# EAGLE design Single_Driver (EAGLE 8.5.2)
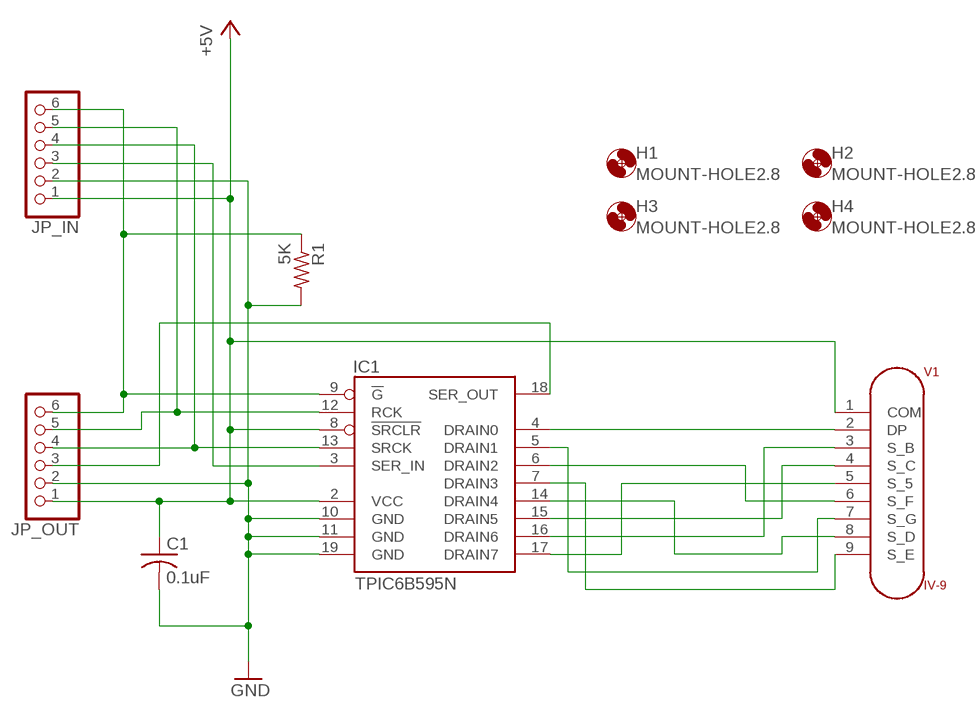
[diagram p0: schematic, sheet 1]

## Parts
C1  0.1uF  C-US025-025X050  [C025-025X050]
H1  MOUNT-HOLE2.8  [2,8]
H2  MOUNT-HOLE2.8  [2,8]
H3  MOUNT-HOLE2.8  [2,8]
H4  MOUNT-HOLE2.8  [2,8]
IC1  TPIC6B595N  [DIL20]
JP_IN  PINHD-1X6  [1X06]
JP_OUT  PINHD-1X6  [1X06]
R1  5K  R-US_0207/9  [0207/9]
V1  IV-9  [TO100]

## Nets
+5V: C1.1 IC1.2(VCC) IC1.8(!SRCLR) JP_IN.1 JP_OUT.1 V1.1(COM)
GND: C1.2 IC1.10(GND) IC1.11(GND) IC1.19(GND) JP_IN.2 JP_OUT.2 R1.2
N$1: IC1.4(DRAIN0) V1.2(DP)
N$2: IC1.16(DRAIN6) V1.3(S_B)
N$3: IC1.15(DRAIN5) V1.4(S_C)
N$4: IC1.17(DRAIN7) V1.5(S_5)
N$5: IC1.6(DRAIN2) V1.6(S_F)
N$6: IC1.7(DRAIN3) V1.9(S_E)
N$7: IC1.14(DRAIN4) V1.8(S_D)
N$8: IC1.5(DRAIN1) V1.7(S_G)
N$9: IC1.9(!G) JP_IN.6 JP_OUT.6 R1.1
RCLK: IC1.12(RCK) JP_IN.5 JP_OUT.5
SER_IN: IC1.3(SER_IN) JP_IN.3
SER_OUT: IC1.18(SER_OUT) JP_OUT.3
SRCK: IC1.13(SRCK) JP_IN.4 JP_OUT.4

## Library data of the parts
C1 = adafruit:C-US: CAPACITOR, American symbol
H1-H4 = holes:MOUNT-HOLE: MOUNTING HOLE with drill center marker
IC1 = TPIC6B595:TPIC6B595
JP_IN JP_OUT = adafruit:PINHD-1X6: PIN HEADER
R1 = adafruit:R-US_: RESISTOR, American symbol
V1 = iv9:IV-9

## Board
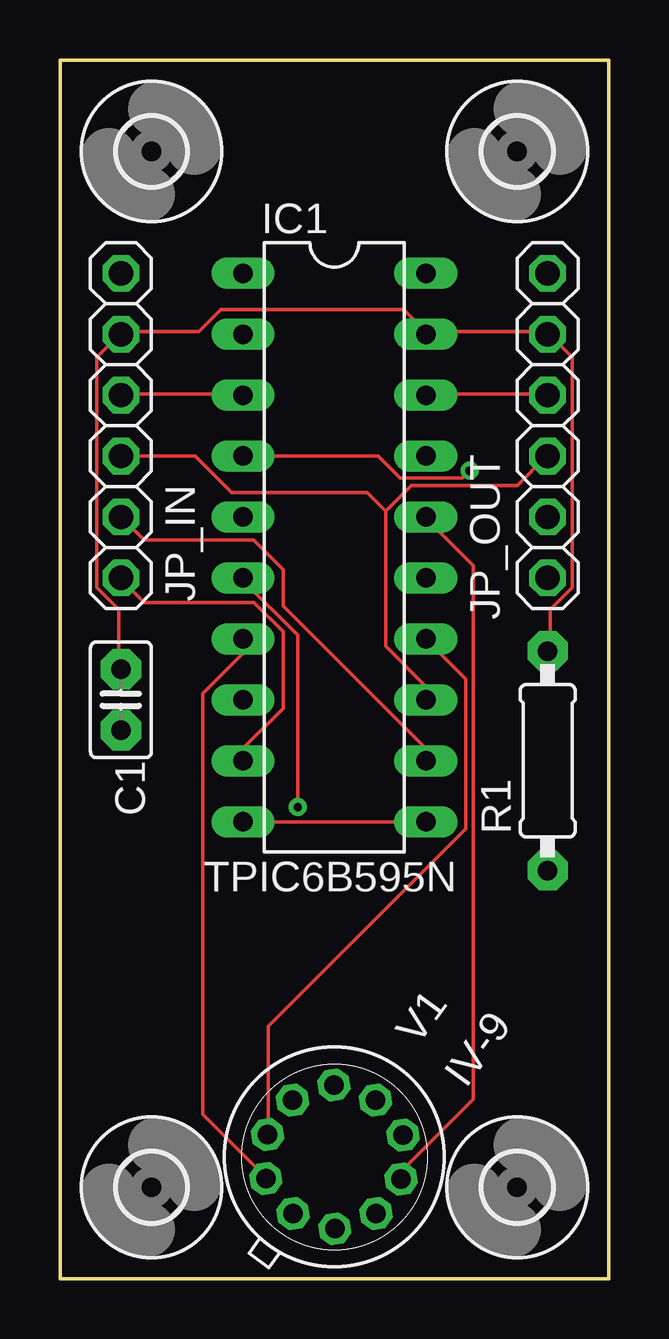
[diagram p1: board, top side]
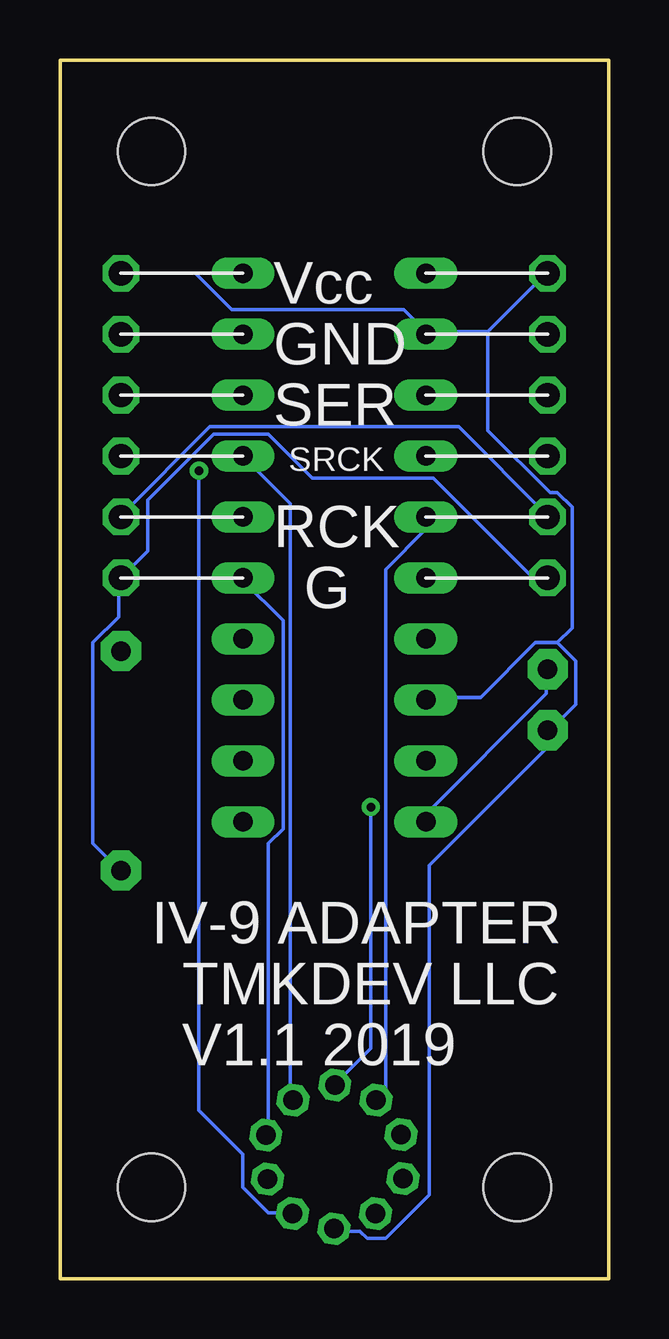
[diagram p2: board, bottom side, seen from below]

Size 22.86 x 50.8 mm. Coordinates in mm from the lower left corner, seen from the top.
Outline: 0,0 0,50.8 22.86,50.8 22.86,0 0,0
Copper layers (1*16): Top 0.035mm / dielectric 1.5mm / Bottom 0.035mm
Design rules "default": minimum track width 6mil, minimum drill 0.35mm, track to track 6mil, track to pad 6mil, pad to pad 6mil, via to via 6mil, smd to smd 6mil, copper to edge 40mil, drill to drill 6mil, minimum pad ring 10mil, minimum via ring 8mil, stop-mask expansion 4mil, vias tented up to drill 0mil, thermal gap 10mil

### Footprints (pad centres in the part's own frame; a part is rotated, then mirrored left to right if it is on the bottom)
C025-025X050 = drill 0.813 pad 1.676 octagon: 1 -1.27,0; 2 1.27,0
2,8 = hole 2.8: 0,0
DIL20 = drill 0.813 long: 1 -11.43,-3.81; 2 -8.89,-3.81; 3 -6.35,-3.81; 4 -3.81,-3.81; 5 -1.27,-3.81; 6 1.27,-3.81; 7 3.81,-3.81; 8 6.35,-3.81; 9 8.89,-3.81; 10 11.43,-3.81; 11 11.43,3.81; 12 8.89,3.81; 13 6.35,3.81; 14 3.81,3.81; 15 1.27,3.81; 16 -1.27,3.81; 17 -3.81,3.81; 18 -6.35,3.81; 19 -8.89,3.81; 20 -11.43,3.81
1X06 = drill 1.016 octagon: 1 -6.35,0; 2 -3.81,0; 3 -1.27,0; 4 1.27,0; 5 3.81,0; 6 6.35,0
0207/9 = drill 0.813 pad 1.676 octagon: 1 -4.572,0; 2 4.572,0
TO100 = drill 0.813 octagon: 1 -2.413,-1.778; 2 -0.889,-2.794; 3 0.889,-2.794; 4 2.413,-1.778; 5 2.921,0; 6 2.413,1.778; 7 0.889,2.794; 8 -0.889,2.794; 9 -2.413,1.778; 10 -2.921,0

### Placement (x,y rotation side)
C1  2.54,24.13 90 top
H1  3.81,3.81 0 top
H2  19.05,3.81 0 top
H3  3.81,46.99 0 top
H4  19.05,46.99 0 top
IC1  11.43,30.48 270 top
JP_IN  2.54,35.56 270 top
JP_OUT  20.32,35.56 270 top
R1  20.32,21.59 90 top
V1  11.43,5.08 54 top

### Tracks (layer width: path | path; a pad name or v marks a point on that pad's centre or on a via)
+5V
  Bottom 0.152: 5.03,39.47 7.62,39.47 | 5.03,39.47 2.59,41.91 JP_IN.1 | JP_OUT.1 17.22,41.91 15.7,40.39 8.53,40.39 7.62,39.47 | 7.62,39.47 IC1.2 | 2.13,26.52 3.05,26.52 5.33,24.23 7.62,24.23 IC1.8 | 2.13,26.52 1.37,25.76 1.37,23.93 2.44,22.86 C1.1 2.59,22.86 2.59,22.1 7.47,17.22 7.47,3.5 9.3,1.68 10.06,1.68 10.36,1.98 11.43,1.98 V1.1 | 5.03,39.47 5.03,35.36 2.44,32.77 2.13,32.77 1.52,32.16 1.52,27.13 2.13,26.52
GND
  Top 0.152: IC1.11 IC1.10 | 15.24,39.47 20.27,39.47 JP_OUT.2 20.42,39.32 21.34,38.41 21.34,28.8 20.42,27.89 20.42,26.21 R1.2 | 15.24,39.47 14.33,40.39 6.71,40.39 5.79,39.47 2.59,39.47 JP_IN.2 2.44,39.32 1.52,38.41 1.52,28.8 2.44,27.89 2.44,25.45 C1.2 | 15.24,39.47 IC1.19
  Bottom 0.152: IC1.10 7.62,19.36 2.59,24.38 2.59,25.3 C1.2
N$1  (via drill 0.35)
  Top 0.152: IC1.4 13.26,34.29 14.17,33.38 16.76,33.38 v17.07,33.68
  Bottom 0.152: v17.07,33.68 17.07,7.01 15.24,5.18 15.24,3.81 14.17,2.74 13.26,2.74 V1.2
N$2
  Top 0.152: V1.3 14.33,4.27 14.33,4.57 17.22,7.47 17.22,29.72 15.24,31.7 IC1.16
N$3
  Bottom 0.152: V1.4 14.17,6.1 14.17,18.14 13.56,18.75 13.56,27.43 15.24,29.11 IC1.15
N$4
  Bottom 0.152: IC1.17 13.26,32.31 13.26,7.47 V1.5
N$5  (via drill 0.35)
  Top 0.152: v9.91,19.66 9.91,26.82 7.62,29.11 IC1.6
  Bottom 0.152: v9.91,19.66 9.91,9.6 11.28,8.23 V1.6
N$6
  Top 0.152: IC1.7 7.62,26.06 5.94,24.38 5.94,6.86 8.53,4.27 V1.9
N$7
  Top 0.152: IC1.14 16.92,24.99 16.92,18.75 8.69,10.52 8.69,6.1 V1.8
N$8
  Bottom 0.152: IC1.5 7.62,31.24 9.3,29.57 9.3,7.77 9.6,7.47 V1.7
N$9
  Top 0.152: IC1.9 7.62,22.1 9.3,23.77 9.3,26.98 8.08,28.19 3.5,28.19 2.59,29.11 JP_IN.6
  Bottom 0.152: R1.1 20.42,17.07 21.49,18.14 21.49,26.52 20.42,27.58 20.42,29.11 JP_OUT.6 19.2,30.33 19.2,32.46 16.46,35.2 14.17,35.2 12.34,33.38 7.32,33.38 3.2,29.26 2.59,29.26 JP_IN.6
RCLK
  Top 0.152: IC1.12 15.24,22.1 9.3,28.04 9.3,29.57 8.08,30.79 3.5,30.79 JP_IN.5
  Bottom 0.152: JP_OUT.5 20.27,31.85 16.61,35.51 6.25,35.51 2.59,31.85 JP_IN.5
SER_IN
  Top 0.152: IC1.3 7.62,36.88 2.59,36.88 JP_IN.3
SER_OUT
  Top 0.152: IC1.18 15.24,36.88 20.27,36.88 JP_OUT.3
SRCK
  Top 0.152: IC1.13 15.24,24.69 13.56,26.36 13.56,32 | 13.56,32 14.63,33.07 19.05,33.07 20.27,34.29 JP_OUT.4 | JP_IN.4 5.64,34.29 7.16,32.77 12.8,32.77 13.56,32

### Text on the board
bNames: Vcc | GND | SER | SRCK | RCK | G | IV-9 ADAPTER | TMKDEV LLC | V1.1 2019